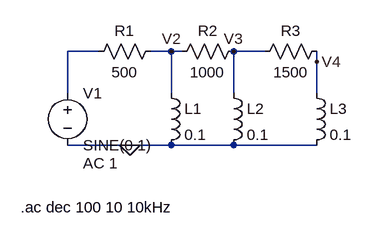
[diagram p0: schematic PassaAlto.asc]
PassaAlto.asc, the LTspice schematic file:
Version 4.1
SHEET 1 880 680
WIRE 80 64 32 64
WIRE 192 64 160 64
WIRE 208 64 192 64
WIRE 336 64 288 64
WIRE 416 80 416 64
WIRE 32 128 32 64
WIRE 192 128 192 64
WIRE 288 128 288 64
WIRE 416 128 416 80
WIRE 128 208 32 208
WIRE 192 208 128 208
WIRE 288 208 192 208
WIRE 416 208 288 208
FLAG 128 208 0
FLAG 416 80 V4
FLAG 288 64 V3
FLAG 192 64 V2
SYMBOL voltage 32 112 R0
WINDOW 123 24 124 Left 2
WINDOW 39 0 0 Left 0
SYMATTR InstName V1
SYMATTR Value SINE(0 1)
SYMATTR Value2 AC 1
SYMBOL res 176 48 R90
WINDOW 0 0 56 VBottom 2
WINDOW 3 32 56 VTop 2
SYMATTR InstName R1
SYMATTR Value 500
SYMBOL res 304 48 R90
WINDOW 0 0 56 VBottom 2
WINDOW 3 32 56 VTop 2
SYMATTR InstName R2
SYMATTR Value 1000
SYMBOL ind 176 112 R0
SYMATTR InstName L1
SYMATTR Value 0.1
SYMATTR SpiceLine Rser=1m
SYMBOL ind 272 112 R0
SYMATTR InstName L2
SYMATTR Value 0.1
SYMATTR SpiceLine Rser=1m
SYMBOL res 432 48 R90
WINDOW 0 0 56 VBottom 2
WINDOW 3 32 56 VTop 2
SYMATTR InstName R3
SYMATTR Value 1500
SYMBOL ind 400 112 R0
SYMATTR InstName L3
SYMATTR Value 0.1
SYMATTR SpiceLine Rser=1m
TEXT -40 304 Left 2 !.ac dec 100 10 10kHz

The netlist it stands for:
* PassaAlto.asc
V1 N001 0 SINE(0 1) AC 1
R1 V2 N001 500
R2 V3 V2 1000
L1 V2 0 0.1 Rser=1m
L2 V3 0 0.1 Rser=1m
R3 V4 V3 1500
L3 V4 0 0.1 Rser=1m
.ac dec 100 10 10kHz
.backanno
.end

* Results of the author's LTspice run, read from the files saved beside the schematic
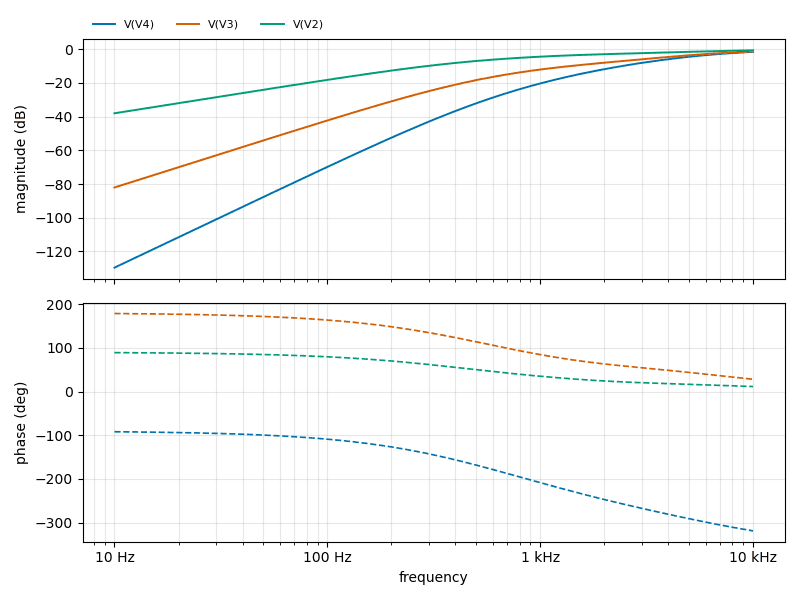
[diagram p1: AC Analysis of PassaAlto.asc, plotted from the saved traces]
* AC Analysis, 1 run:
*   V(V4): -129.61 dB at 10 Hz, -1.57 dB at 10 kHz, peak -1.57 dB at 10 kHz, 3 dB below the peak at 4.921 kHz
*   V(V3): -82.05 dB at 10 Hz, -1.33 dB at 10 kHz, peak -1.33 dB at 10 kHz, 3 dB below the peak at 4.225 kHz
*   V(V2): -38.02 dB at 10 Hz, -0.65 dB at 10 kHz, peak -0.65 dB at 10 kHz, 3 dB below the peak at 1.366 kHz